# EAGLE design ARE_adaptadora_dsPIC-PIC32_64pin (EAGLE 6.5.0)
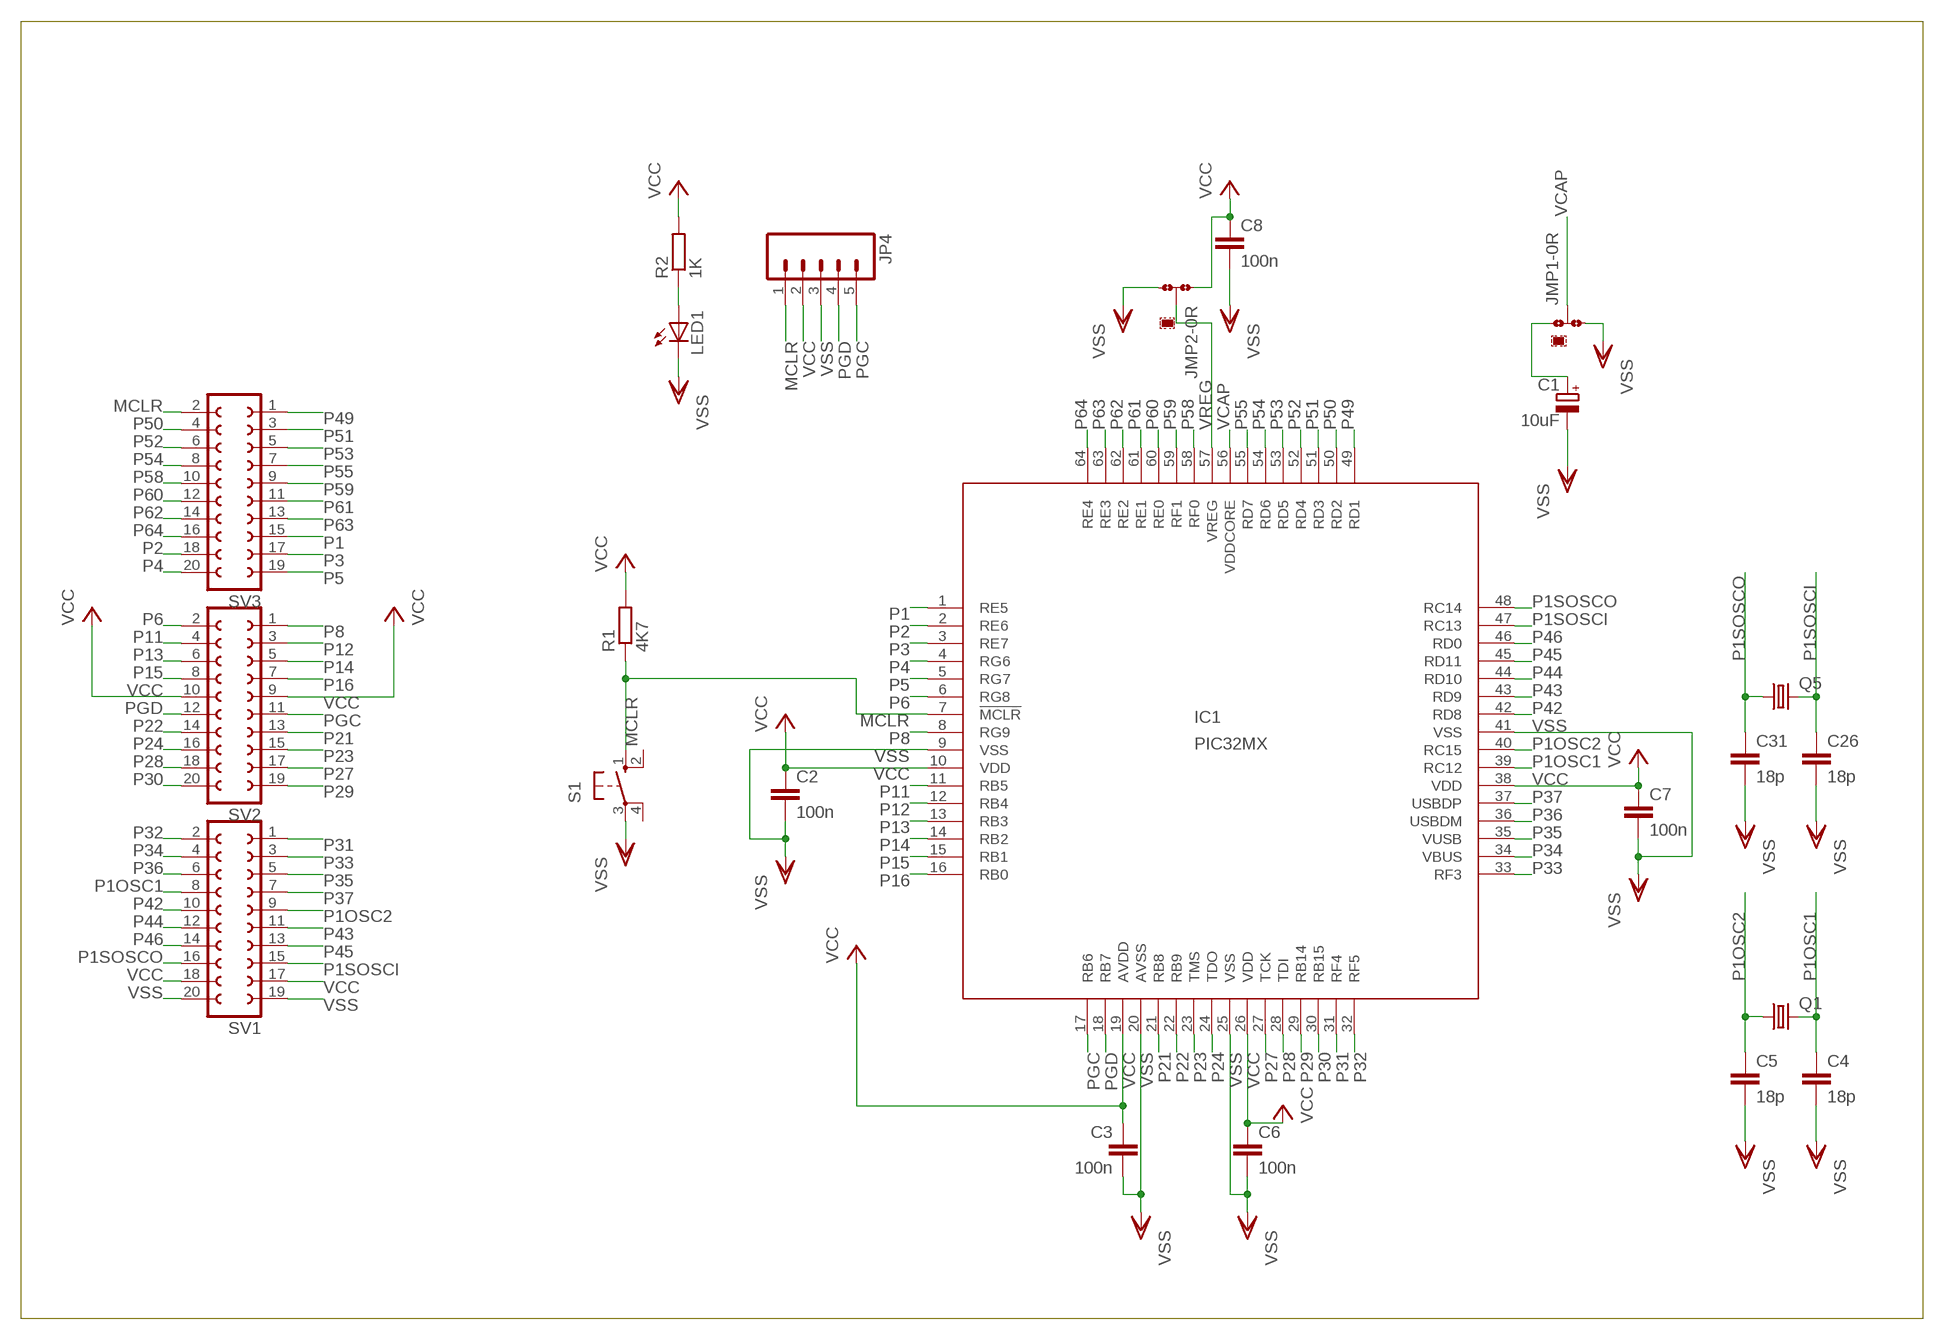
[diagram p0: schematic, sheet 1]

## Parts
C1  10uF  CPOL-EUSMCC  [SMC_C]
C2  100n  C-EUC0805  [C0805]
C3  100n  C-EUC0805  [C0805]
C4  18p  C-EUC0805  [C0805]
C5  18p  C-EUC0805  [C0805]
C6  100n  C-EUC0805  [C0805]
C7  100n  C-EUC0805  [C0805]
C8  100n  C-EUC0805  [C0805]
C26  18p  C-EUC0805  [C0805]
C31  18p  C-EUC0805  [C0805]
IC1  PIC32MX  PIC32MX440F256H  [TQFP64-10X10]
JMP1  0R-JUMPA  [A0R-JMP]
JMP2  0R-JUMPA  [A0R-JMP]
JP4  M05PTH  [1X05]
LED1  LEDCHIPLED_0805  [CHIPLED_0805]
Q1  CRYSTALHC18U-V  [HC18U-V]
Q5  CRYSTALHC18U-V  [HC18U-V]
R1  4K7  R-EU_R0805  [R0805]
R2  1K  R-EU_R0805  [R0805]
S1  10-XX  [B3F-10XX]
SV1  FE10-2W  [FE10-2W]
SV2  FE10-2W  [FE10-2W]
SV3  FE10-2W  [FE10-2W]

## Nets
MCLR: IC1.7(!MCLR) JP4.1 R1.1 S1.1(S) SV3.2
N$1: LED1.A R2.1
N$5: C1.+ JMP1.1
P1: IC1.1(RE5) SV3.15
P1OSC1: C4.1 IC1.39(RC12) Q1.2 SV1.8
P1OSC2: C5.1 IC1.40(RC15) Q1.1 SV1.9
P1SOSCI: C26.1 IC1.47(RC13) Q5.2 SV1.15
P1SOSCO: C31.1 IC1.48(RC14) Q5.1 SV1.16
P2: IC1.2(RE6) SV3.18
P3: IC1.3(RE7) SV3.17
P4: IC1.4(RG6) SV3.20
P5: IC1.5(RG7) SV3.19
P6: IC1.6(RG8) SV2.2
P8: IC1.8(RG9) SV2.1
P11: IC1.11(RB5) SV2.4
P12: IC1.12(RB4) SV2.3
P13: IC1.13(RB3) SV2.6
P14: IC1.14(RB2) SV2.5
P15: IC1.15(RB1) SV2.8
P16: IC1.16(RB0) SV2.7
P21: IC1.21(RB8) SV2.13
P22: IC1.22(RB9) SV2.14
P23: IC1.23(TMS) SV2.15
P24: IC1.24(TDO) SV2.16
P27: IC1.27(TCK) SV2.17
P28: IC1.28(TDI) SV2.18
P29: IC1.29(RB14) SV2.19
P30: IC1.30(RB15) SV2.20
P31: IC1.31(RF4) SV1.1
P32: IC1.32(RF5) SV1.2
P33: IC1.33(RF3) SV1.3
P34: IC1.34(VBUS) SV1.4
P35: IC1.35(VUSB) SV1.5
P36: IC1.36(USBDM) SV1.6
P37: IC1.37(USBDP) SV1.7
P42: IC1.42(RD8) SV1.10
P43: IC1.43(RD9) SV1.11
P44: IC1.44(RD10) SV1.12
P45: IC1.45(RD11) SV1.13
P46: IC1.46(RD0) SV1.14
P49: IC1.49(RD1) SV3.1
P50: IC1.50(RD2) SV3.4
P51: IC1.51(RD3) SV3.3
P52: IC1.52(RD4) SV3.6
P53: IC1.53(RD5) SV3.5
P54: IC1.54(RD6) SV3.8
P55: IC1.55(RD7) SV3.7
P58: IC1.58(RF0) SV3.10
P59: IC1.59(RF1) SV3.9
P60: IC1.60(RE0) SV3.12
P61: IC1.61(RE1) SV3.11
P62: IC1.62(RE2) SV3.14
P63: IC1.63(RE3) SV3.13
P64: IC1.64(RE4) SV3.16
PGC: IC1.17(RB6) JP4.5 SV2.11
PGD: IC1.18(RB7) JP4.4 SV2.12
VCAP: IC1.56(VDDCORE) JMP1.2
VCC: C2.1 C3.1 C6.1 C7.1 C8.1 IC1.10(VDD) IC1.19(AVDD) IC1.26(VDD) IC1.38(VDD) JMP2.1 JP4.2 R1.2 R2.2 SV1.17 SV1.18 SV2.9 SV2.10
VREG: IC1.57(VREG) JMP2.2
VSS: C1.- C2.2 C3.2 C4.2 C5.2 C6.2 C7.2 C8.2 C26.2 C31.2 IC1.9(VSS) IC1.20(AVSS) IC1.25(VSS) IC1.41(VSS) JMP1.3 JMP2.3 JP4.3 LED1.C S1.3(P) SV1.19 SV1.20
Unconnected: S1.2(S1) S1.4(P1)

## Library data of the parts
C1 = rcl:CPOL-EU: POLARIZED CAPACITOR, European symbol
C2-C8 C26 C31 = rcl:C-EU: CAPACITOR, European symbol
IC1 = microchip_nuevo:PIC32MX440F256H: PIC32MX440F256H edit this description Auto generated by make-symbol-device-package-bsdl.ulp Rev. 25 Source: PIC32MX440F256H.bsdl
JMP1 JMP2 = jump-0r-smd:0R-JUMP: SMD 0R 0805 Jumper
JP4 = SparkFun:M05: Header 5 Standard 5-pin 0.1" header. Use with straight break away headers (SKU : PRT-00116), right angle break away headers (PRT-00553), swiss pins (PRT-00743), machine pins (PRT-00117), and female headers (PRT-00115). Molex polarized connector foot print use with SKU : PRT-08230 with associated crimp pins and housings.
LED1 = led:LED: LED OSRAM: - CHIPLED LG R971, LG N971, LY N971, LG Q971, LY Q971, LO R971, LY R971 LH N974, LH R974 LS Q976, LO Q976, LY Q976 LO Q996 - Hyper CHIPLED LW Q18S LB Q993, LB Q99A, LB R99A - SideLED LS A670, LO A670, LY A670, LG A670, LP A670 LB A673, LV A673, LT A673, LW A673 LH A674 LY A675 LS A676, LA A676, LO A676, LY A676, LW A676 LS A679, LY A679, LG A679 - Hyper Micro SIDELED® LS Y876, LA Y876, LO Y876, LY Y876 LT Y87S - SmartLED LW L88C, LW L88S LB L89C, LB L89S, LG L890 LS L89K, LO L89K, LY L89K LS L896, LA L896, LO L896, LY L896 - TOPLED LS T670, LO T670, LY T670, LG T670, LP T670 LSG T670, LSP T670, LSY T670, LOP T670, LYG T670 LG T671, LOG T671, LSG T671 LB T673, LV T673, LT T673, LW T673 LH T674 LS T676, LA T676, LO T676, LY T676, LB T676, LH T676, LSB T676, LW T676 LB T67C, LV T67C, LT T67C, LS T67K, LO T67K, LY T67K, LW E67C LS E67B, LA E67B, LO E67B, LY E67B, LB E67C, LV E67C, LT E67C LW T67C LS T679, LY T679, LG T679 LS T770, LO T770, LY T770, LG T770, LP T770 LB T773, LV T773, LT T773, LW T773 LH T774 LS E675, LA E675, LY E675, LS T675 LS T776, LA T776, LO T776, LY T776, LB T776 LHGB T686 LT T68C, LB T68C - Hyper Mini TOPLED® LB M676 - Mini TOPLED Santana® LG M470 LS M47K, LO M47K, LY M47K Source: http://www.osram.convergy.de LUXEON: - LUMILED® LXK2-PW12-R00, LXK2-PW12-S00, LXK2-PW14-U00, LXK2-PW14-V00 LXK2-PM12-R00, LXK2-PM12-S00, LXK2-PM14-U00 LXK2-PE12-Q00, LXK2-PE12-R00, LXK2-PE12-S00, LXK2-PE14-T00, LXK2-PE14-U00 LXK2-PB12-K00, LXK2-PB12-L00, LXK2-PB12-M00, LXK2-PB14-N00, LXK2-PB14-P00, LXK2-PB14-Q00 LXK2-PR12-L00, LXK2-PR12-M00, LXK2-PR14-Q00, LXK2-PR14-R00 LXK2-PD12-Q00, LXK2-PD12-R00, LXK2-PD12-S00 LXK2-PH12-R00, LXK2-PH12-S00 LXK2-PL12-P00, LXK2-PL12-Q00, LXK2-PL12-R00 Source: www.luxeon.com KINGBRIGHT: KA-3528ASYC Source: www.kingbright.com
Q1 Q5 = crystal:CRYSTAL: CRYSTAL; OC_FARNELL: unknown; OC_NEWARK: unknown
R1 R2 = rcl:R-EU_: RESISTOR, European symbol
S1 = switch-omron:10-XX: OMRON SWITCH; MPN: B3F-1000; OC_FARNELL: 176432; OC_NEWARK: 36M3542
SV1-SV3 = con-lsta:FE10-2W: FEMALE HEADER; OC_FARNELL: unknown; OC_NEWARK: unknown

## Board
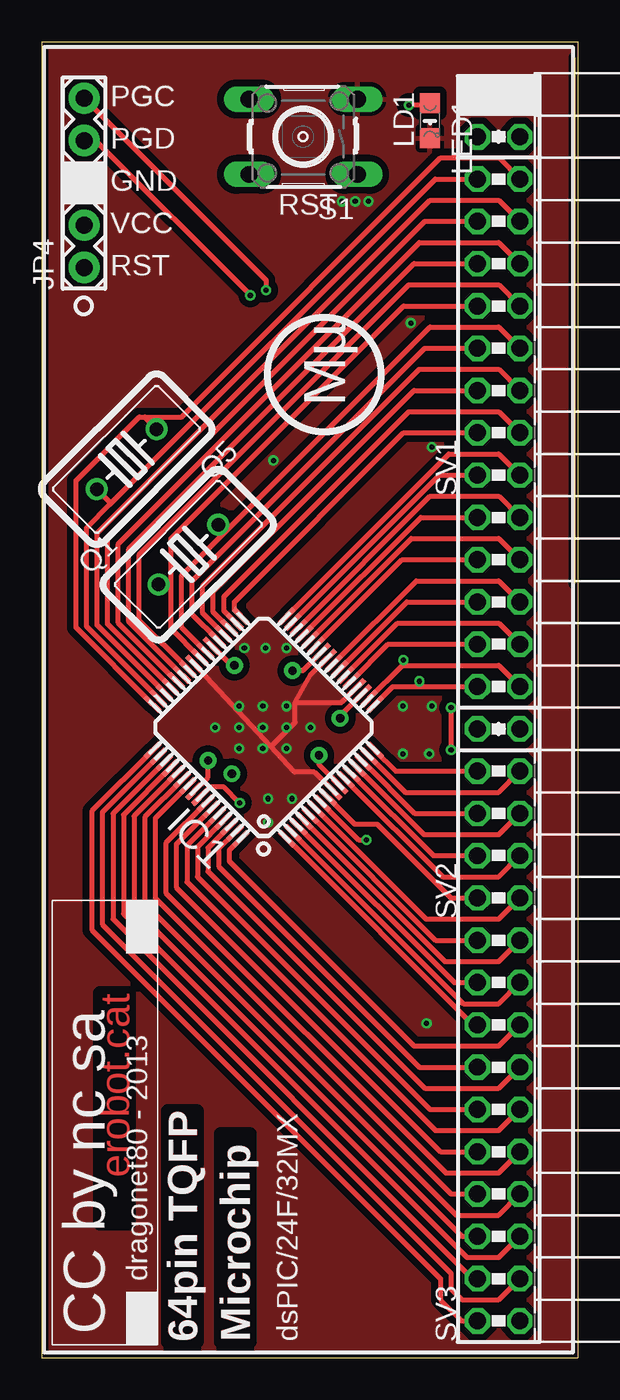
[diagram p1: board, top side]
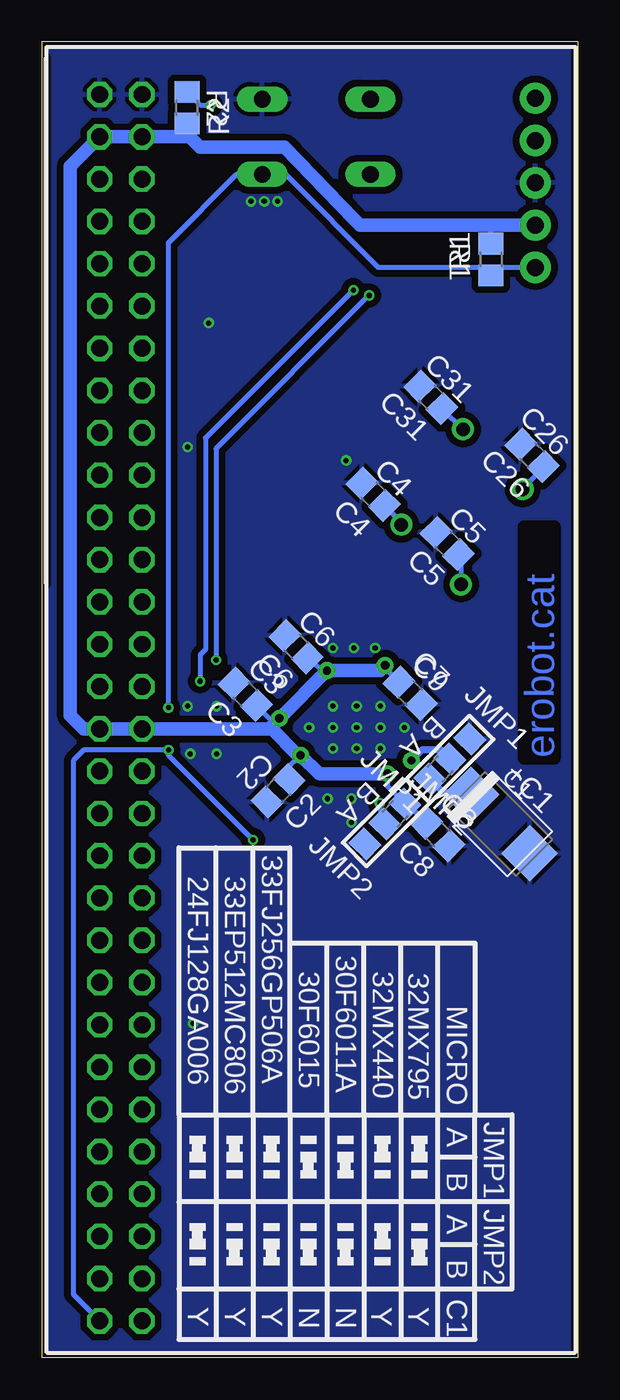
[diagram p2: board, bottom side, seen from below]

Size 32.23 x 79.06 mm. Coordinates in mm from the lower left corner, seen from the top.
Outline: 32.07,46.51 32.07,78.1
Outline: 0,79.06 32.23,79.06 32.23,0 0,0 0,79.06
Copper layers (1*16): Top 0.035mm / dielectric 1.5mm / Bottom 0.035mm
Design rules "ITEADstudio_DRC": minimum track width 6mil, minimum drill 12mil, track to track 6mil, track to pad 6mil, pad to pad 6mil, via to via 6mil, smd to smd 0mil, copper to edge 10mil, drill to drill 10mil, minimum pad ring 10mil, minimum via ring 6mil, stop-mask expansion 2mil, vias tented up to drill 100mil, thermal gap 10mil

### Footprints (pad centres in the part's own frame; a part is rotated, then mirrored left to right if it is on the bottom)
SMC_C = smd 2.4 x 2.4: + -2.5,0; - 2.5,0
C0805 = smd 1.3 x 1.5: 1 -0.95,0; 2 0.95,0
TQFP64-10X10 = smd 1.2 x 0.3: 1 -5.7,3.75; 2 -5.7,3.25; 3 -5.7,2.75; 4 -5.7,2.25; 5 -5.7,1.75; 6 -5.7,1.25; 7 -5.7,0.75; 8 -5.7,0.25; 9 -5.7,-0.25; 10 -5.7,-0.75; 11 -5.7,-1.25; 12 -5.7,-1.75; 13 -5.7,-2.25; 14 -5.7,-2.75; 15 -5.7,-3.25; 16 -5.7,-3.75; 33 5.7,-3.75; 34 5.7,-3.25; 35 5.7,-2.75; 36 5.7,-2.25; 37 5.7,-1.75; 38 5.7,-1.25; 39 5.7,-0.75; 40 5.7,-0.25; 41 5.7,0.25; 42 5.7,0.75; 43 5.7,1.25; 44 5.7,1.75; 45 5.7,2.25; 46 5.7,2.75; 47 5.7,3.25; 48 5.7,3.75 | smd 0.3 x 1.2: 17 -3.75,-5.7; 18 -3.25,-5.7; 19 -2.75,-5.7; 20 -2.25,-5.7; 21 -1.75,-5.7; 22 -1.25,-5.7; 23 -0.75,-5.7; 24 -0.25,-5.7; 25 0.25,-5.7; 26 0.75,-5.7; 27 1.25,-5.7; 28 1.75,-5.7; 29 2.25,-5.7; 30 2.75,-5.7; 31 3.25,-5.7; 32 3.75,-5.7; 49 3.75,5.7; 50 3.25,5.7; 51 2.75,5.7; 52 2.25,5.7; 53 1.75,5.7; 54 1.25,5.7; 55 0.75,5.7; 56 0.25,5.7; 57 -0.25,5.7; 58 -0.75,5.7; 59 -1.25,5.7; 60 -1.75,5.7; 61 -2.25,5.7; 62 -2.75,5.7; 63 -3.25,5.7; 64 -3.75,5.7
A0R-JMP = smd 1.5 x 1.3: 1 0,1.7; 2 0,0; 3 0,-1.7
1X05 = drill 1.016 pad 1.88: 1 0,0; 2 2.54,0; 3 5.08,0; 4 7.62,0; 5 10.16,0
CHIPLED_0805 = smd 1.2 x 1.2: A 0,-1.05; C 0,1.05
HC18U-V = drill 0.813: 1 -2.54,0; 2 2.54,0
R0805 = smd 1.3 x 1.5: 1 -0.95,0; 2 0.95,0
B3F-10XX = drill 1.016 long: 1 -3.251,2.261; 2 3.251,2.261; 3 -3.251,-2.261; 4 3.251,-2.261
FE10-2W = drill 1.016 octagon: 1 -11.43,1.27; 2 -11.43,-1.27; 3 -8.89,1.27; 4 -8.89,-1.27; 5 -6.35,1.27; 6 -6.35,-1.27; 7 -3.81,1.27; 8 -3.81,-1.27; 9 -1.27,1.27; 10 -1.27,-1.27; 11 1.27,1.27; 12 1.27,-1.27; 13 3.81,1.27; 14 3.81,-1.27; 15 6.35,1.27; 16 6.35,-1.27; 17 8.89,1.27; 18 8.89,-1.27; 19 11.43,1.27; 20 11.43,-1.27

### Placement (x,y rotation side)
C1  4.66,32.07 315 bottom
C2  18.02,34.07 225 bottom
C3  19.98,39.85 135 bottom
C4  12.31,51.87 135 bottom
C5  7.85,48.91 135 bottom
C6  16.94,42.71 135 bottom
C7  10.08,39.92 315 bottom
C8  8.41,31.43 315 bottom
C26  2.74,54.21 135 bottom
C31  8.83,57.7 135 bottom
IC1  13.35,37.87 135 top
JMP1  7.69,35.97 135 bottom
JMP2  11.59,32.07 315 bottom
JP4  2.56,65.49 90 top
LED1  23.34,74.3 180 top
Q1  8.81,48.25 45 top
Q5  5.11,53.98 225 top
R1  5.22,65.97 90 bottom
R2  23.49,75.09 270 bottom
S1  15.72,73.34 180 top
SV1  27.46,64.45 90 top
SV2  27.46,39.05 90 top
SV3  27.46,13.65 90 top

### Tracks (layer width: path | path; a pad name or v marks a point on that pad's centre or on a via)
MCLR  (via drill 0.3 pad 0.61)
  Top 0.305: IC1.7 19.05,31.11 v19.53,31.11 | v24.61,39.05 v24.61,36.51
  Bottom 0.305: v19.53,31.11 24.61,36.19 v24.61,36.51 29.69,36.51 30.32,35.88 30.32,3.81 SV3.2 | v24.61,39.05 24.61,66.99 20.52,71.08 S1.1 17.58,71.08 11.99,65.49 5.08,65.49 | JP4.1 5.08,65.49 | R1.1 5.22,65.35 5.08,65.49
N$1  (via drill 0.3 pad 0.61)
  Top 0.305: LED1.A 23.24,75.25 v22.07,75.25
  Bottom 0.305: R2.1 22.7,75.25 v22.07,75.25
N$5
  Bottom 0.406: JMP1.1 8.09,33.97 6.56,33.97 C1.+
P1
  Top 0.305: IC1.1 25.92,20 SV3.15
P1OSC1
  Top 0.305: IC1.39 8.41,43.87 8.41,46.99 10.95,49.53 | 10.95,49.53 23.34,61.91 27.46,61.91 SV1.8 | Q1.2 10.95,49.71 10.95,49.53
  Bottom 0.305: C4.1 10.61,50.18 Q1.2
P1OSC2
  Top 0.305: IC1.40 7.78,43.8 7.78,46.35 | 7.78,46.35 7.78,49.21 21.75,63.18 SV1.9 | Q1.1 7.12,46.35 7.78,46.35
  Bottom 0.305: C5.1 7.02,48.08 Q1.1
P1SOSCI
  Top 0.305: IC1.47 2.7,43.93 2.7,49.85 4.13,51.28 | 4.13,51.28 23.65,70.8 SV1.15 | Q5.2 4.13,51.36 4.13,51.28
  Bottom 0.305: C26.1 Q5.2
P1SOSCO
  Top 0.305: IC1.48 2.06,43.86 2.06,52.7 5.87,56.51 6.19,56.51 | 6.19,56.51 8.41,56.51 23.97,72.07 27.46,72.07 SV1.16 | Q5.1 6.19,56.48 6.19,56.51
  Bottom 0.305: C31.1 Q5.1
P2
  Top 0.305: IC1.2 25.36,21.27 27.46,21.27 SV3.18
P3
  Top 0.305: IC1.3 24.79,22.54 SV3.17
P4
  Top 0.305: IC1.4 24.23,23.81 27.46,23.81 SV3.20
P5
  Top 0.305: IC1.5 23.67,25.08 SV3.19
P6
  Top 0.305: IC1.6 23.1,26.35 27.46,26.35 SV2.2
P8
  Top 0.305: IC1.8 18.8,32.07 20.16,32.07 24.61,27.62 SV2.1
P11
  Top 0.305: IC1.11 24.1,28.89 27.46,28.89 SV2.4
P12
  Top 0.305: IC1.12 23.54,30.16 SV2.3
P13
  Top 0.305: IC1.13 22.97,31.43 27.46,31.43 SV2.6
P14
  Top 0.305: IC1.14 22.41,32.7 SV2.5
P15
  Top 0.305: IC1.15 21.85,33.97 27.46,33.97 SV2.8
P16
  Top 0.305: IC1.16 21.29,35.24 SV2.7
P21
  Top 0.305: IC1.21 20.82,42.86 SV2.13
P22
  Top 0.305: IC1.22 21.38,44.13 27.46,44.13 SV2.14
P23
  Top 0.305: IC1.23 21.95,45.4 SV2.15
P24
  Top 0.305: IC1.24 22.51,46.67 27.46,46.67 SV2.16
P27
  Top 0.305: IC1.27 21.66,47.94 SV2.17
P28
  Top 0.305: IC1.28 22.22,49.21 27.46,49.21 SV2.18
P29
  Top 0.305: IC1.29 22.78,50.48 SV2.19
P30
  Top 0.305: IC1.30 23.35,51.75 27.46,51.75 SV2.20
P31
  Top 0.305: IC1.31 23.91,53.02 SV1.1
P32
  Top 0.305: IC1.32 24.47,54.29 27.46,54.29 SV1.2
P33
  Top 0.305: IC1.33 11.59,44.94 11.59,45.4 21.75,55.56 SV1.3
P34
  Top 0.305: IC1.34 10.95,44.87 10.95,45.72 22.07,56.83 27.46,56.83 SV1.4
P35
  Top 0.305: IC1.35 10.32,44.8 10.32,46.04 22.38,58.1 SV1.5
P36
  Top 0.305: IC1.36 9.68,44.72 9.68,46.35 22.7,59.37 27.46,59.37 SV1.6
P37
  Top 0.305: IC1.37 9.05,44.65 9.05,46.67 23.02,60.64 SV1.7
P42
  Top 0.305: IC1.42 5.87,44.29 5.87,48.26 22.07,64.45 27.46,64.45 SV1.10
P43
  Top 0.305: IC1.43 5.24,44.22 5.24,48.58 22.38,65.72 SV1.11
P44
  Top 0.305: IC1.44 4.6,44.15 4.6,48.89 22.7,66.99 27.46,66.99 SV1.12
P45
  Top 0.305: IC1.45 3.97,44.07 3.97,49.21 23.02,68.26 SV1.13
P46
  Top 0.305: IC1.46 3.33,44 3.33,49.53 23.34,69.53 27.46,69.53 SV1.14
P49
  Top 0.305: IC1.49 3.02,32.84 3.02,25.72 23.97,4.76 23.97,3.49 25.24,2.22 SV3.1
P50
  Top 0.305: IC1.50 3.65,32.76 3.65,26.03 24.61,5.08 24.61,4.13 25.24,3.49 27.46,3.49 SV3.4
P51
  Top 0.305: IC1.51 4.29,32.69 4.29,26.35 25.88,4.76 SV3.3
P52
  Top 0.305: IC1.52 4.92,32.62 4.92,26.67 25.56,6.03 27.46,6.03 SV3.6
P53
  Top 0.305: IC1.53 5.56,32.55 5.56,26.99 25.24,7.3 SV3.5
P54
  Top 0.305: IC1.54 6.19,32.48 6.19,27.3 24.92,8.57 27.46,8.57 SV3.8
P55
  Top 0.305: IC1.55 6.83,32.4 6.83,27.62 24.61,9.84 SV3.7
P58
  Top 0.305: IC1.58 7.46,30.92 7.46,27.94 24.29,11.11 27.46,11.11 SV3.10
P59
  Top 0.305: IC1.59 8.1,30.85 8.1,28.26 23.97,12.38 SV3.9
P60
  Top 0.305: IC1.60 8.73,30.77 8.73,28.57 23.65,13.65 27.46,13.65 SV3.12
P61
  Top 0.305: IC1.61 9.37,30.7 9.37,28.89 23.34,14.92 SV3.11
P62
  Top 0.305: IC1.62 10,30.63 10,29.21 23.02,16.19 27.46,16.19 SV3.14
P63
  Top 0.305: IC1.63 10.64,30.56 10.64,29.53 22.7,17.46 SV3.13
P64
  Top 0.305: IC1.64 11.27,30.49 11.27,29.84 22.38,18.73 27.46,18.73 SV3.16
PGC  (via drill 0.3 pad 0.61)
  Top 0.305: IC1.17 21.11,40.32 22.7,40.32 | 22.7,40.32 SV2.11 | JP4.5 13.49,64.72 v13.49,64.13 | v22.7,40.64 22.7,40.32
  Bottom 0.305: v13.49,64.13 22.38,55.24 22.38,42.54 22.7,42.23 v22.7,40.64
PGD  (via drill 0.3 pad 0.61)
  Top 0.305: IC1.18 21.67,41.59 21.75,41.59 | 21.75,41.59 27.46,41.59 SV2.12 | JP4.4 3.24,73.11 v12.54,63.82 | v21.75,41.91 21.75,41.59
  Bottom 0.305: v12.54,63.82 21.75,54.61 v21.75,41.91
VCAP  (via drill 0.5 pad 1.02)
  Top 0.305: IC1.56 10,34.87 v10,35.88
  Bottom 0.406: JMP1.2 8.23,36.51 9.37,36.51 v10,35.88
VCC  (via drill 0.5 pad 1.02)
  Top 0.305: IC1.26 15.7,41.27 v15.08,41.27 | IC1.19 17.79,38.42 v17.94,38.42 | IC1.38 11.4,41.59 v11.59,41.59 | IC1.10 16.67,35.62 v16.67,36.19
  Bottom 0.305: v15.08,41.27 15.59,41.46 C6.1 | C7.1 11.59,41.43 v11.59,41.59 | C3.1 18.55,38.42 v17.94,38.42 | v16.67,36.19 17.5,35.36 C2.1 | R1.2 5.22,68.01 5.24,68.03 | C8.1 10.07,33.09 JMP2.1 11.43,34.31 v11.43,35.08
  Bottom 0.406: R2.2 23.49,73.5 23.34,73.34
  Bottom 0.61: 18.57,37.78 18.48,37.87
  Bottom 0.813: v11.59,41.59 11.91,41.27 v15.08,41.27 v17.94,38.42 18.48,37.87 16.81,36.19 v16.67,36.19 15.59,35.12 15.47,35.08 v11.43,35.08 | 18.57,37.78 SV2.9 SV2.10 29.69,37.78 30.5,38.6 30.5,71.58 SV1.18 SV1.17 23.34,73.34 23.33,73.34 22.7,72.71 17.62,72.71 13.42,68.35 13.11,68.03 5.24,68.03 JP4.2
VREG  (via drill 0.3 pad 0.61)
  Top 0.305: v11.91,33.34 10.95,34.29 10.13,34.29 IC1.57
  Bottom 0.305: JMP2.2 11.91,33.02 v11.91,33.34
VSS  (via drill 0.3 pad 0.61)
  Top 0.305: 13.75,36.76 15.2,35.19 16.39,35.19 IC1.9 | 13.75,36.76 IC1.41 | 18.44,39.78 IC1.20 18.06,39.4 | 18.06,39.4 18.05,39.4 | 15.24,39.37 15.24,38.17 13.99,36.92 13.83,36.76 13.75,36.76 | 15.24,39.37 16.19,41.06 IC1.25 | 15.24,39.37 18.03,39.37 18.06,39.4
  other vias: 23.45,39.14 23.29,36.28 23.45,54.7 13.29,39.14 13.29,36.6 14.72,37.87 11.86,37.87 22.18,62.16 21.7,39.14 14.72,42.63 21.7,36.28 13.93,53.91 23.13,20.09 13.61,33.59 13.45,42.63 19.64,69.46 14.72,36.6 11.86,36.6 11.86,39.14 13.29,37.87 14.72,39.14 16.15,37.87 10.43,37.87 15.04,33.59 13.61,32.16 12.18,42.63 18.85,69.46 18.05,69.46
  pour Top (isolate 0.406): 0.27,0.41 0.27,78.51 31.96,78.51 31.96,0.41
  pour Bottom (isolate 0.406): 0.27,0.41 0.27,78.51 31.93,78.51 31.93,0.41

### Text on the board
Top: erobot.cat | 64pin TQFP | Microchip
Bottom: erobot.cat
_tsilk: PGC | PGD | LD1 | GND | RST | VCC | RST | Mµ | dragonet80 - 2013 | CC by nc sa | 64pin TQFP | Microchip | dsPIC/24F/32MX
_bsilk: R2 | R1 | C31 | C26 | C4 | C5 | C6 | C9 | C3 | JMP1 | B | A | C2 | +C1 | B | A | JMP2 | C8 | 33FJ256GP506A | 33EP512MC806 | 24FJ128GA006 | 30F6011A | 32MX795 | 32MX440 | 30F6015 | MICRO | JMP1 | A | B | JMP2 | A | B | C1 | Y | Y | N | N | Y | Y | Y